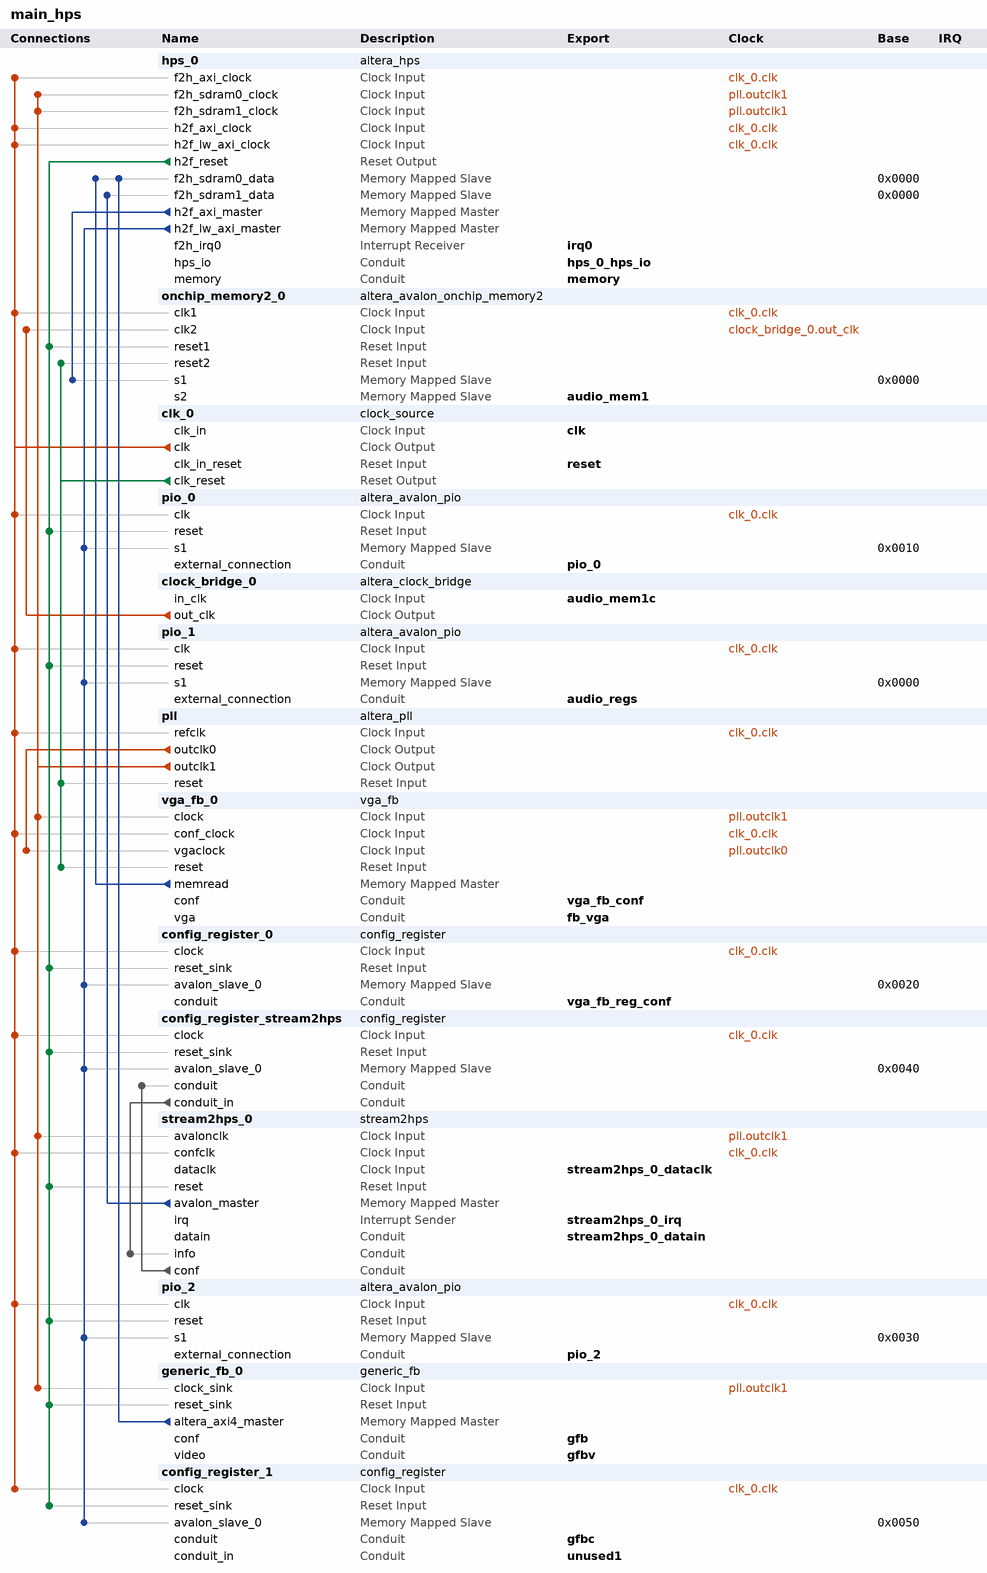
[diagram p0: system contents]
# Platform Designer (Qsys) system main_hps, Cyclone V 5CSEMA5F31C6
# Parameters at their usual value, and those the tool derives, are not listed.
package require -exact qsys 15.1
create_system main_hps
set_project_property DEVICE_FAMILY {Cyclone V}
set_project_property DEVICE 5CSEMA5F31C6

add_instance hps_0 altera_hps 15.1
set_instance_parameter_value hps_0 EMAC1_Mode RGMII
set_instance_parameter_value hps_0 EMAC1_PinMuxing {HPS I/O Set 0}
set_instance_parameter_value hps_0 F2SCLK_COLDRST_Enable false
set_instance_parameter_value hps_0 F2SCLK_DBGRST_Enable false
set_instance_parameter_value hps_0 F2SCLK_WARMRST_Enable false
set_instance_parameter_value hps_0 F2SDRAM_Type {Avalon-MM Read-Only,Avalon-MM Write-Only}
set_instance_parameter_value hps_0 F2SDRAM_Width 64,64
set_instance_parameter_value hps_0 F2SINTERRUPT_Enable true
set_instance_parameter_value hps_0 F2S_Width 2
set_instance_parameter_value hps_0 FPGA_PERIPHERAL_OUTPUT_CLOCK_FREQ_EMAC0_GTX_CLK 100
set_instance_parameter_value hps_0 FPGA_PERIPHERAL_OUTPUT_CLOCK_FREQ_EMAC0_MD_CLK 100.0
set_instance_parameter_value hps_0 FPGA_PERIPHERAL_OUTPUT_CLOCK_FREQ_EMAC1_GTX_CLK 100
set_instance_parameter_value hps_0 FPGA_PERIPHERAL_OUTPUT_CLOCK_FREQ_EMAC1_MD_CLK 100.0
set_instance_parameter_value hps_0 HPS_PROTOCOL DDR3
set_instance_parameter_value hps_0 I2C0_Mode I2C
set_instance_parameter_value hps_0 I2C0_PinMuxing {HPS I/O Set 0}
set_instance_parameter_value hps_0 I2C1_Mode I2C
set_instance_parameter_value hps_0 I2C1_PinMuxing {HPS I/O Set 0}
set_instance_parameter_value hps_0 LWH2F_Enable true
set_instance_parameter_value hps_0 MEM_BANKADDR_WIDTH 3
set_instance_parameter_value hps_0 MEM_CLK_FREQ 400.0
set_instance_parameter_value hps_0 MEM_COL_ADDR_WIDTH 10
set_instance_parameter_value hps_0 MEM_DQ_WIDTH 32
set_instance_parameter_value hps_0 MEM_DRV_STR RZQ/7
set_instance_parameter_value hps_0 MEM_ROW_ADDR_WIDTH 15
set_instance_parameter_value hps_0 MEM_RTT_NOM RZQ/4
set_instance_parameter_value hps_0 MEM_RTT_WR RZQ/4
set_instance_parameter_value hps_0 MEM_TCL 11
set_instance_parameter_value hps_0 MEM_TFAW_NS 30.0
set_instance_parameter_value hps_0 MEM_TRAS_NS 35.0
set_instance_parameter_value hps_0 MEM_TRCD_NS 13.75
set_instance_parameter_value hps_0 MEM_TRFC_NS 260.0
set_instance_parameter_value hps_0 MEM_TRP_NS 13.75
set_instance_parameter_value hps_0 MEM_VENDOR JEDEC
set_instance_parameter_value hps_0 MEM_WTCL 8
set_instance_parameter_value hps_0 QSPI_Mode {1 SS}
set_instance_parameter_value hps_0 QSPI_PinMuxing {HPS I/O Set 0}
set_instance_parameter_value hps_0 REF_CLK_FREQ 25.0
set_instance_parameter_value hps_0 S2FCLK_USER2CLK 4
set_instance_parameter_value hps_0 S2F_Width 2
set_instance_parameter_value hps_0 SDIO_Mode {4-bit Data}
set_instance_parameter_value hps_0 SDIO_PinMuxing {HPS I/O Set 0}
set_instance_parameter_value hps_0 SPIM1_Mode {Single Slave Select}
set_instance_parameter_value hps_0 SPIM1_PinMuxing {HPS I/O Set 0}
set_instance_parameter_value hps_0 STM_Enable false
set_instance_parameter_value hps_0 TIMING_BOARD_AC_SKEW 0.03
set_instance_parameter_value hps_0 TIMING_BOARD_AC_TO_CK_SKEW 0.0
set_instance_parameter_value hps_0 TIMING_BOARD_DQ_TO_DQS_SKEW 0.0
set_instance_parameter_value hps_0 TIMING_BOARD_MAX_CK_DELAY 0.03
set_instance_parameter_value hps_0 TIMING_BOARD_MAX_DQS_DELAY 0.02
set_instance_parameter_value hps_0 TIMING_BOARD_SKEW_BETWEEN_DQS 0.08
set_instance_parameter_value hps_0 TIMING_BOARD_SKEW_CKDQS_DIMM_MAX 0.16
set_instance_parameter_value hps_0 TIMING_BOARD_SKEW_CKDQS_DIMM_MIN 0.09
set_instance_parameter_value hps_0 TIMING_BOARD_SKEW_WITHIN_DQS 0.01
set_instance_parameter_value hps_0 TIMING_TDH 65
set_instance_parameter_value hps_0 TIMING_TDQSCK 255
set_instance_parameter_value hps_0 TIMING_TDQSQ 125
set_instance_parameter_value hps_0 TIMING_TDS 30
set_instance_parameter_value hps_0 TIMING_TIH 140
set_instance_parameter_value hps_0 TIMING_TIS 180
set_instance_parameter_value hps_0 TIMING_TQSH 0.4
set_instance_parameter_value hps_0 UART0_Mode {No Flow Control}
set_instance_parameter_value hps_0 UART0_PinMuxing {HPS I/O Set 0}
set_instance_parameter_value hps_0 USB1_Mode SDR
set_instance_parameter_value hps_0 USB1_PinMuxing {HPS I/O Set 0}
set_instance_parameter_value hps_0 desired_cfg_clk_mhz 100.0
set_instance_parameter_value hps_0 desired_qspi_clk_mhz 400.0

add_instance onchip_memory2_0 altera_avalon_onchip_memory2 15.1
set_instance_parameter_value onchip_memory2_0 dataWidth 64
set_instance_parameter_value onchip_memory2_0 dualPort true
set_instance_parameter_value onchip_memory2_0 initMemContent true
set_instance_parameter_value onchip_memory2_0 initializationFileName /home/xaxaxa/a.hex
set_instance_parameter_value onchip_memory2_0 memorySize 65536

add_instance clk_0 clock_source 15.1
set_instance_parameter_value clk_0 clockFrequency 50000000

add_instance pio_0 altera_avalon_pio 15.1
set_instance_parameter_value pio_0 direction Output
set_instance_parameter_value pio_0 width 32

add_instance clock_bridge_0 altera_clock_bridge 15.1
set_instance_parameter_value clock_bridge_0 DERIVED_CLOCK_RATE 0
set_instance_parameter_value clock_bridge_0 EXPLICIT_CLOCK_RATE 0

add_instance pio_1 altera_avalon_pio 15.1
set_instance_parameter_value pio_1 direction Input
set_instance_parameter_value pio_1 width 32

add_instance pll altera_pll 15.1
set_instance_parameter_value pll gui_actual_output_clock_frequency1 {180.000000 MHz}
set_instance_parameter_value pll gui_device_speed_grade 2
set_instance_parameter_value pll gui_number_of_clocks 2
set_instance_parameter_value pll gui_operation_mode direct
set_instance_parameter_value pll gui_output_clock_frequency0 80.18
set_instance_parameter_value pll gui_output_clock_frequency1 185.0
set_instance_parameter_value pll gui_pll_mode {Integer-N PLL}
set_instance_parameter_value pll gui_reference_clock_frequency 50.0
set_instance_parameter_value pll gui_use_locked false

add_instance vga_fb_0 vga_fb 1.0

add_instance config_register_0 config_register 1.0
set_instance_parameter_value config_register_0 addrlen 2
set_instance_parameter_value config_register_0 dummy 1
set_instance_parameter_value config_register_0 inpWords 0
set_instance_parameter_value config_register_0 words 4

add_instance config_register_stream2hps config_register 1.0
set_instance_parameter_value config_register_stream2hps addrlen 2
set_instance_parameter_value config_register_stream2hps dummy 0
set_instance_parameter_value config_register_stream2hps inpWords 1
set_instance_parameter_value config_register_stream2hps words 2

add_instance stream2hps_0 stream2hps 1.0

add_instance pio_2 altera_avalon_pio 15.1
set_instance_parameter_value pio_2 direction Input
set_instance_parameter_value pio_2 width 32

add_instance generic_fb_0 generic_fb 1.0
set_instance_parameter_value generic_fb_0 burstLength 16

add_instance config_register_1 config_register 1.0
set_instance_parameter_value config_register_1 addrlen 1
set_instance_parameter_value config_register_1 dummy 1
set_instance_parameter_value config_register_1 inpWords 0
set_instance_parameter_value config_register_1 words 2

# connections
add_connection clk_0.clk config_register_0.clock clock
add_connection clk_0.clk config_register_1.clock clock
add_connection clk_0.clk config_register_stream2hps.clock clock
add_connection clk_0.clk hps_0.f2h_axi_clock clock
add_connection clk_0.clk hps_0.h2f_axi_clock clock
add_connection clk_0.clk hps_0.h2f_lw_axi_clock clock
add_connection clk_0.clk onchip_memory2_0.clk1 clock
add_connection clk_0.clk pio_0.clk clock
add_connection clk_0.clk pio_1.clk clock
add_connection clk_0.clk pio_2.clk clock
add_connection clk_0.clk pll.refclk clock
add_connection clk_0.clk stream2hps_0.confclk clock
add_connection clk_0.clk vga_fb_0.conf_clock clock
add_connection clock_bridge_0.out_clk onchip_memory2_0.clk2 clock
add_connection pll.outclk0 vga_fb_0.vgaclock clock
add_connection pll.outclk1 generic_fb_0.clock_sink clock
add_connection pll.outclk1 hps_0.f2h_sdram0_clock clock
add_connection pll.outclk1 hps_0.f2h_sdram1_clock clock
add_connection pll.outclk1 stream2hps_0.avalonclk clock
add_connection pll.outclk1 vga_fb_0.clock clock
add_connection clk_0.clk_reset onchip_memory2_0.reset2 reset
add_connection clk_0.clk_reset pll.reset reset
add_connection clk_0.clk_reset vga_fb_0.reset reset
add_connection hps_0.h2f_reset config_register_0.reset_sink reset
add_connection hps_0.h2f_reset config_register_1.reset_sink reset
add_connection hps_0.h2f_reset config_register_stream2hps.reset_sink reset
add_connection hps_0.h2f_reset generic_fb_0.reset_sink reset
add_connection hps_0.h2f_reset onchip_memory2_0.reset1 reset
add_connection hps_0.h2f_reset pio_0.reset reset
add_connection hps_0.h2f_reset pio_1.reset reset
add_connection hps_0.h2f_reset pio_2.reset reset
add_connection hps_0.h2f_reset stream2hps_0.reset reset
add_connection generic_fb_0.altera_axi4_master hps_0.f2h_sdram0_data avalon
set_connection_parameter_value generic_fb_0.altera_axi4_master/hps_0.f2h_sdram0_data baseAddress 0x0000
add_connection hps_0.h2f_axi_master onchip_memory2_0.s1 avalon
set_connection_parameter_value hps_0.h2f_axi_master/onchip_memory2_0.s1 baseAddress 0x0000
add_connection hps_0.h2f_lw_axi_master config_register_0.avalon_slave_0 avalon
set_connection_parameter_value hps_0.h2f_lw_axi_master/config_register_0.avalon_slave_0 baseAddress 0x0020
add_connection hps_0.h2f_lw_axi_master config_register_1.avalon_slave_0 avalon
set_connection_parameter_value hps_0.h2f_lw_axi_master/config_register_1.avalon_slave_0 baseAddress 0x0050
add_connection hps_0.h2f_lw_axi_master config_register_stream2hps.avalon_slave_0 avalon
set_connection_parameter_value hps_0.h2f_lw_axi_master/config_register_stream2hps.avalon_slave_0 baseAddress 0x0040
add_connection hps_0.h2f_lw_axi_master pio_0.s1 avalon
set_connection_parameter_value hps_0.h2f_lw_axi_master/pio_0.s1 baseAddress 0x0010
add_connection hps_0.h2f_lw_axi_master pio_1.s1 avalon
set_connection_parameter_value hps_0.h2f_lw_axi_master/pio_1.s1 baseAddress 0x0000
add_connection hps_0.h2f_lw_axi_master pio_2.s1 avalon
set_connection_parameter_value hps_0.h2f_lw_axi_master/pio_2.s1 baseAddress 0x0030
add_connection stream2hps_0.avalon_master hps_0.f2h_sdram1_data avalon
set_connection_parameter_value stream2hps_0.avalon_master/hps_0.f2h_sdram1_data baseAddress 0x0000
add_connection vga_fb_0.memread hps_0.f2h_sdram0_data avalon
set_connection_parameter_value vga_fb_0.memread/hps_0.f2h_sdram0_data baseAddress 0x0000
add_connection config_register_stream2hps.conduit_in stream2hps_0.info conduit
add_connection stream2hps_0.conf config_register_stream2hps.conduit conduit

# exported interfaces
add_interface audio_mem1 avalon slave
set_interface_property audio_mem1 EXPORT_OF onchip_memory2_0.s2
add_interface audio_mem1c clock sink
set_interface_property audio_mem1c EXPORT_OF clock_bridge_0.in_clk
add_interface audio_regs conduit end
set_interface_property audio_regs EXPORT_OF pio_1.external_connection
add_interface clk clock sink
set_interface_property clk EXPORT_OF clk_0.clk_in
add_interface fb_vga conduit end
set_interface_property fb_vga EXPORT_OF vga_fb_0.vga
add_interface gfb conduit end
set_interface_property gfb EXPORT_OF generic_fb_0.conf
add_interface gfbc conduit end
set_interface_property gfbc EXPORT_OF config_register_1.conduit
add_interface gfbv conduit end
set_interface_property gfbv EXPORT_OF generic_fb_0.video
add_interface hps_0_hps_io conduit end
set_interface_property hps_0_hps_io EXPORT_OF hps_0.hps_io
add_interface irq0 interrupt receiver
set_interface_property irq0 EXPORT_OF hps_0.f2h_irq0
add_interface memory conduit end
set_interface_property memory EXPORT_OF hps_0.memory
add_interface pio_0 conduit end
set_interface_property pio_0 EXPORT_OF pio_0.external_connection
add_interface pio_2 conduit end
set_interface_property pio_2 EXPORT_OF pio_2.external_connection
add_interface reset reset sink
set_interface_property reset EXPORT_OF clk_0.clk_in_reset
add_interface stream2hps_0_dataclk clock sink
set_interface_property stream2hps_0_dataclk EXPORT_OF stream2hps_0.dataclk
add_interface stream2hps_0_datain conduit end
set_interface_property stream2hps_0_datain EXPORT_OF stream2hps_0.datain
add_interface stream2hps_0_irq interrupt sender
set_interface_property stream2hps_0_irq EXPORT_OF stream2hps_0.irq
add_interface unused1 conduit end
set_interface_property unused1 EXPORT_OF config_register_1.conduit_in
add_interface vga_fb_conf conduit end
set_interface_property vga_fb_conf EXPORT_OF vga_fb_0.conf
add_interface vga_fb_reg_conf conduit end
set_interface_property vga_fb_reg_conf EXPORT_OF config_register_0.conduit

set_interconnect_requirement {$system} qsys_mm.clockCrossingAdapter HANDSHAKE
set_interconnect_requirement {$system} qsys_mm.maxAdditionalLatency 1

save_system main_hps.qsys
